# EAGLE board TwoMegCoCo_MMU_v1.1 (EAGLE 7.7.0)
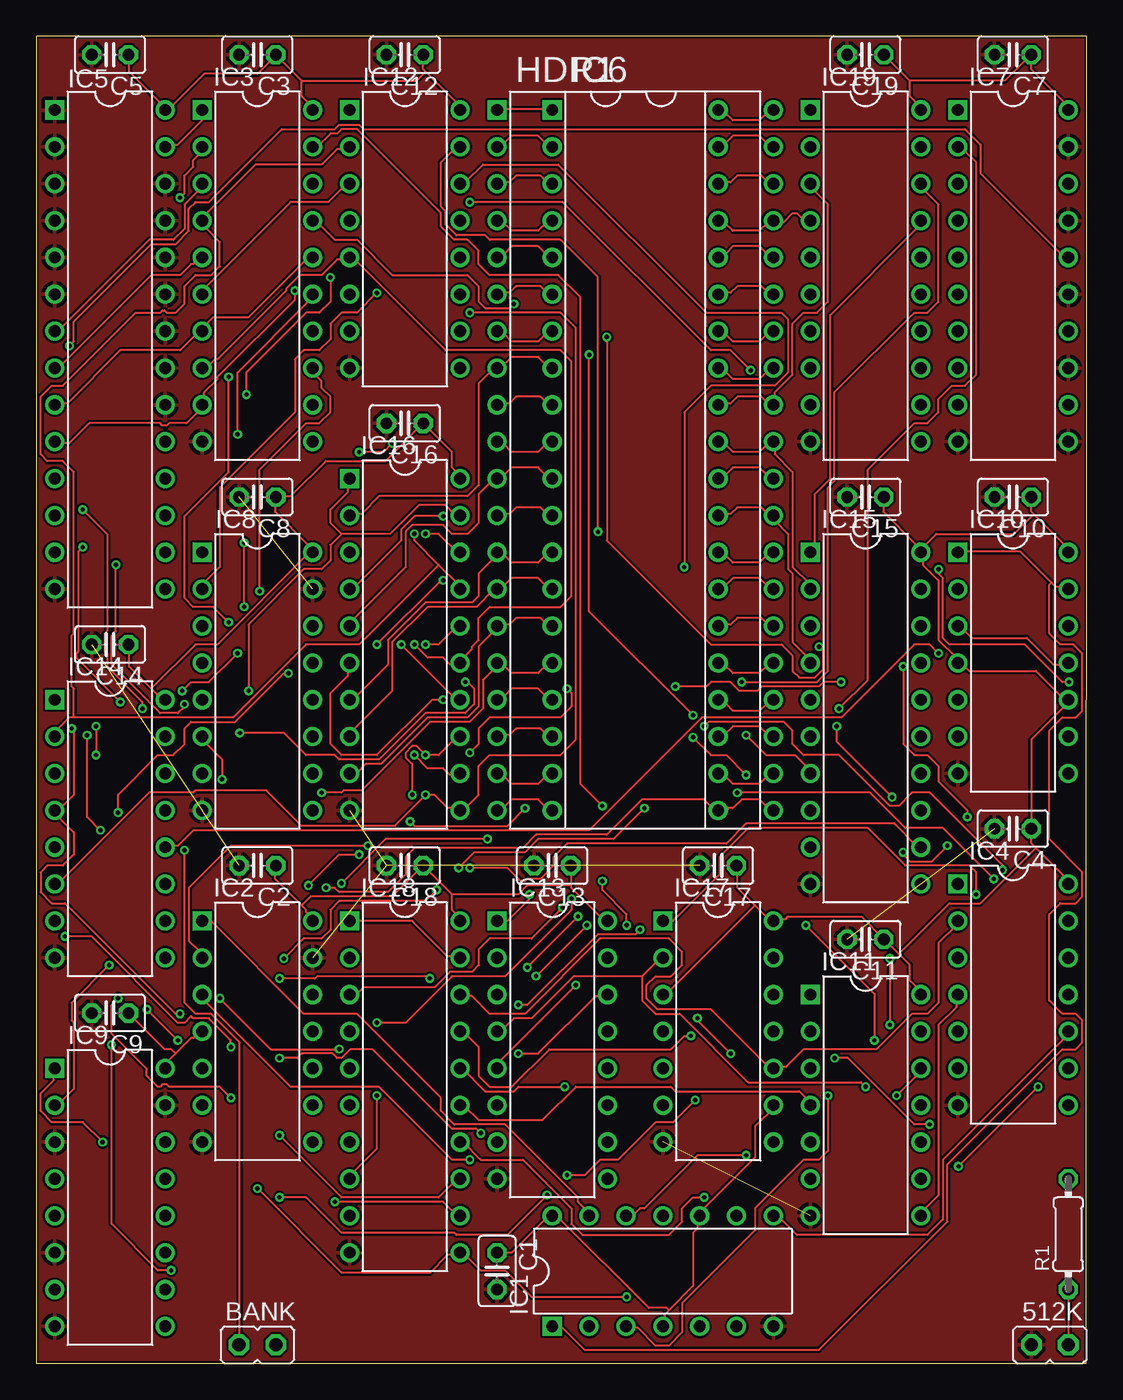
[diagram p1: board, top side]
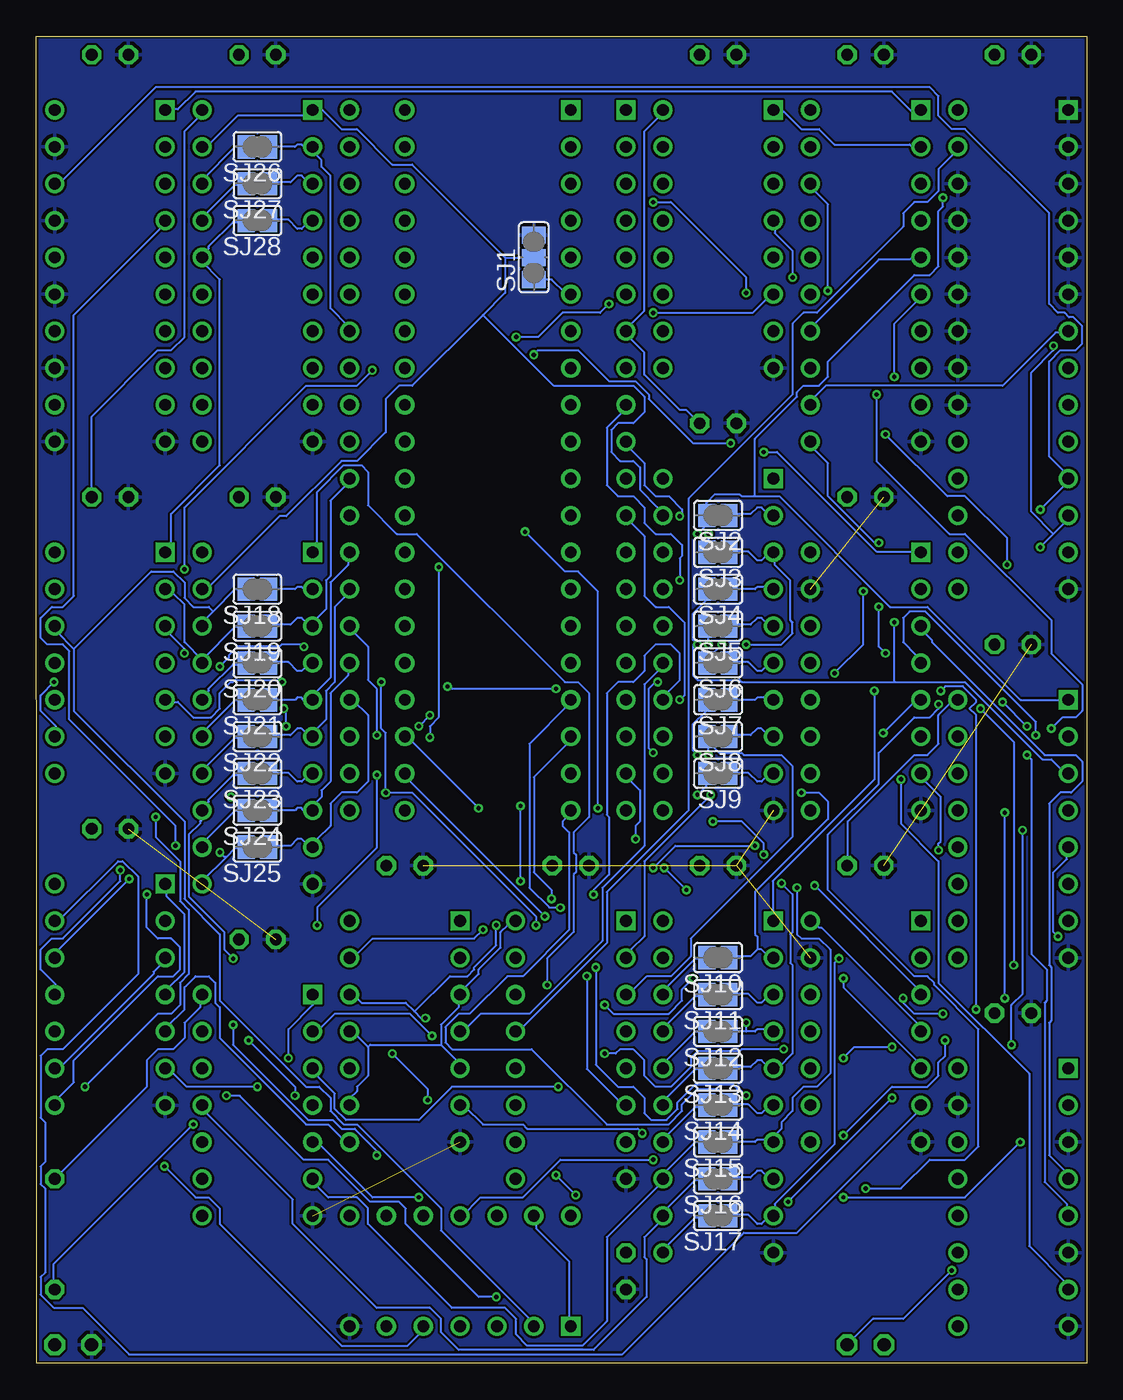
[diagram p2: board, bottom side, seen from below]

Size 72.39 x 91.44 mm. Coordinates in mm from the lower left corner, seen from the top.
Outline: 0,0 72.37,0 72.39,91.44 0,91.44 0,0
Copper layers (1*16): Top 0.035mm / dielectric 1.5mm / Bottom 0.035mm
Design rules "hackvana": minimum track width 6mil, minimum drill 0.3mm, track to track 6mil, track to pad 6mil, pad to pad 6mil, via to via 6mil, smd to smd 0mil, copper to edge 6mil, drill to drill 6mil, minimum pad ring 10mil, minimum via ring 6mil, stop-mask expansion 2mil, vias tented up to drill 100mil, thermal gap 10mil

## Footprints (pad centres in the part's own frame; a part is rotated, then mirrored left to right if it is on the bottom)
JP1 = drill 0.914 octagon: 1 0,-1.27; 2 0,1.27
C025-025X050 = drill 0.813 octagon: 1 -1.27,0; 2 1.27,0
DIL40-ROUNDPAD = drill 0.813 square: 1 -24.13,-7.62 | drill 0.813: 2 -21.59,-7.62; 3 -19.05,-7.62; 4 -16.51,-7.62; 5 -13.97,-7.62; 6 -11.43,-7.62; 7 -8.89,-7.62; 8 -6.35,-7.62; 9 -3.81,-7.62; 10 -1.27,-7.62; 11 1.27,-7.62; 12 3.81,-7.62; 13 6.35,-7.62; 14 8.89,-7.62; 15 11.43,-7.62; 16 13.97,-7.62; 17 16.51,-7.62; 18 19.05,-7.62; 19 21.59,-7.62; 20 24.13,-7.62; 21 24.13,7.62; 22 21.59,7.62; 23 19.05,7.62; 24 16.51,7.62; 25 13.97,7.62; 26 11.43,7.62; 27 8.89,7.62; 28 6.35,7.62; 29 3.81,7.62; 30 1.27,7.62; 31 -1.27,7.62; 32 -3.81,7.62; 33 -6.35,7.62; 34 -8.89,7.62; 35 -11.43,7.62; 36 -13.97,7.62; 37 -16.51,7.62; 38 -19.05,7.62; 39 -21.59,7.62; 40 -24.13,7.62
DIL14-RP = drill 0.813 square: 1 -7.62,-3.81 | drill 0.813: 2 -5.08,-3.81; 3 -2.54,-3.81; 4 0,-3.81; 5 2.54,-3.81; 6 5.08,-3.81; 7 7.62,-3.81; 8 7.62,3.81; 9 5.08,3.81; 10 2.54,3.81; 11 0,3.81; 12 -2.54,3.81; 13 -5.08,3.81; 14 -7.62,3.81
DIL20-RP = drill 0.813 square: 1 -11.43,-3.81 | drill 0.813: 2 -8.89,-3.81; 3 -6.35,-3.81; 4 -3.81,-3.81; 5 -1.27,-3.81; 6 1.27,-3.81; 7 3.81,-3.81; 8 6.35,-3.81; 9 8.89,-3.81; 10 11.43,-3.81; 11 11.43,3.81; 12 8.89,3.81; 13 6.35,3.81; 14 3.81,3.81; 15 1.27,3.81; 16 -1.27,3.81; 17 -3.81,3.81; 18 -6.35,3.81; 19 -8.89,3.81; 20 -11.43,3.81
DIL28-3-RP = drill 0.813 square: 1 -16.51,-3.81 | drill 0.813: 2 -13.97,-3.81; 3 -11.43,-3.81; 4 -8.89,-3.81; 5 -6.35,-3.81; 6 -3.81,-3.81; 7 -1.27,-3.81; 8 1.27,-3.81; 9 3.81,-3.81; 10 6.35,-3.81; 11 8.89,-3.81; 12 11.43,-3.81; 13 13.97,-3.81; 14 16.51,-3.81; 15 16.51,3.81; 16 13.97,3.81; 17 11.43,3.81; 18 8.89,3.81; 19 6.35,3.81; 20 3.81,3.81; 21 1.27,3.81; 22 -1.27,3.81; 23 -3.81,3.81; 24 -6.35,3.81; 25 -8.89,3.81; 26 -11.43,3.81; 27 -13.97,3.81; 28 -16.51,3.81
DIL16-RP = drill 0.813 square: 1 -8.89,-3.81 | drill 0.813: 2 -6.35,-3.81; 3 -3.81,-3.81; 4 -1.27,-3.81; 5 1.27,-3.81; 6 3.81,-3.81; 7 6.35,-3.81; 8 8.89,-3.81; 9 8.89,3.81; 10 6.35,3.81; 11 3.81,3.81; 12 1.27,3.81; 13 -1.27,3.81; 14 -3.81,3.81; 15 -6.35,3.81; 16 -8.89,3.81
0204/7 = drill 0.813 octagon: 1 -3.81,0; 2 3.81,0
SJ_2 = smd 1.168 x 1.6: 1 -1.524,0; 2 0,0; 3 1.524,0
SJ = smd 1.168 x 1.6: 1 -0.762,0; 2 0.762,0

## Placement (x,y rotation side)
512K  [JP1]  69.85,1.27 90 top
BANK  [JP1]  15.24,1.27 90 top
C1  [C025-025X050]  31.75,6.35 270 top
C2  [C025-025X050]  15.24,34.29 180 top
C3  [C025-025X050]  15.24,90.17 180 top
C4  [C025-025X050]  67.31,36.83 180 top
C5  [C025-025X050]  5.08,90.17 180 top
C7  [C025-025X050]  67.31,90.17 180 top
C8  [C025-025X050]  15.24,59.69 180 top
C9  [C025-025X050]  5.08,24.13 180 top
C10  [C025-025X050]  67.31,59.69 180 top
C11  [C025-025X050]  57.15,29.21 180 top
C12  [C025-025X050]  25.4,90.17 180 top
C13  [C025-025X050]  35.56,34.29 180 top
C14  [C025-025X050]  5.08,49.53 180 top
C15  [C025-025X050]  57.15,59.69 180 top
C16  [C025-025X050]  25.4,64.77 180 top
C17  [C025-025X050]  46.99,34.29 180 top
C18  [C025-025X050]  25.4,34.29 180 top
C19  [C025-025X050]  57.15,90.17 180 top
HDR1  MC6809ER  [DIL40-ROUNDPAD]  39.37,62.23 270 top
IC1  74HCT74N  [DIL14-RP]  43.18,6.35 0 top
IC2  74HCT74N  [DIL14-RP]  15.24,22.86 270 top
IC3  74LS244N  [DIL20-RP]  15.24,74.93 270 top
IC4  74LS32N  [DIL14-RP]  67.31,25.4 270 top
IC5  JEDEC_32KB_SRAM-TRP  [DIL28-3-RP]  5.08,69.85 270 top
IC6  MC6809ER  [DIL40-ROUNDPAD]  43.18,62.23 270 top
IC7  74LS244N  [DIL20-RP]  67.31,74.93 270 top
IC8  74LS157N  [DIL16-RP]  15.24,46.99 270 top
IC9  74LS157N  [DIL16-RP]  5.08,11.43 270 top
IC10  74LS74N  [DIL14-RP]  67.31,48.26 270 top
IC11  74LS30N  [DIL14-RP]  57.15,17.78 270 top
IC12  74LS138N  [DIL16-RP]  25.4,77.47 270 top
IC13  74LS138N  [DIL16-RP]  35.56,21.59 270 top
IC14  74LS138N  [DIL16-RP]  5.08,36.83 270 top
IC15  74LS245N  [DIL20-RP]  57.15,44.45 270 top
IC16  74LS541N  [DIL20-RP]  25.4,49.53 270 top
IC17  74LS10N  [DIL14-RP]  46.99,22.86 270 top
IC18  74LS541N  [DIL20-RP]  25.4,19.05 270 top
IC19  74LS541N  [DIL20-RP]  57.15,74.93 270 top
R1  10K  [0204/7]  71.12,8.89 90 top
SJ1  [SJ_2]  38.1,76.2 90 bottom
SJ2  [SJ]  25.4,58.42 180 bottom
SJ3  [SJ]  25.4,55.88 180 bottom
SJ4  [SJ]  25.4,53.34 180 bottom
SJ5  [SJ]  25.4,50.8 180 bottom
SJ6  [SJ]  25.4,48.26 180 bottom
SJ7  [SJ]  25.4,45.72 180 bottom
SJ8  [SJ]  25.4,43.18 180 bottom
SJ9  [SJ]  25.4,40.64 180 bottom
SJ10  [SJ]  25.4,27.94 180 bottom
SJ11  [SJ]  25.4,25.4 180 bottom
SJ12  [SJ]  25.4,22.86 180 bottom
SJ13  [SJ]  25.4,20.32 180 bottom
SJ14  [SJ]  25.4,17.78 180 bottom
SJ15  [SJ]  25.4,15.24 180 bottom
SJ16  [SJ]  25.4,12.7 180 bottom
SJ17  [SJ]  25.4,10.16 180 bottom
SJ18  [SJ]  57.15,53.34 180 bottom
SJ19  [SJ]  57.15,50.8 180 bottom
SJ20  [SJ]  57.15,48.26 180 bottom
SJ21  [SJ]  57.15,45.72 180 bottom
SJ22  [SJ]  57.15,43.18 180 bottom
SJ23  [SJ]  57.15,40.64 180 bottom
SJ24  [SJ]  57.15,38.1 180 bottom
SJ25  [SJ]  57.15,35.56 180 bottom
SJ26  [SJ]  57.15,83.82 180 bottom
SJ27  [SJ]  57.15,81.28 180 bottom
SJ28  [SJ]  57.15,78.74 180 bottom

## Tracks (layer width: path | path; a pad name or v marks a point on that pad's centre or on a via)
!A3  (via drill 0.3)
  Top 0.152: v1.98,29.41 3.81,29.41 9.75,23.47 10.21,23.47 10.67,23.93 10.82,23.77 11.89,23.77 13.41,22.25 v13.41,21.79 | v16.76,21.03 17.98,21.03 18.29,21.34 20.42,21.34 20.73,21.03 21.03,21.03 21.64,21.64 23.16,21.64 28.65,16.15 30.33,16.15 v30.63,15.85
  Bottom 0.152: v1.98,29.41 2.29,29.72 2.29,33.83 1.37,34.75 1.37,35.51 IC14.5 | v13.41,21.79 16,21.79 v16.76,21.03 | v30.63,15.85 30.94,16.15 38.56,16.15 38.86,16.46 41.6,16.46 42.82,17.68 43.13,17.68 IC17.6
!A8
  Bottom 0.152: IC17.8 50.9,15.24 51.21,15.54 51.36,15.54 52.27,16.46 53.8,16.46 59.74,22.4 59.74,24.54 60.05,24.84 60.05,26.21 60.5,26.67 61.42,26.67 62.18,25.91 62.18,24.38 63.4,23.16 63.4,22.86 IC4.5
!CE_FEXX
  Bottom 0.152: IC4.9 71.02,20.42 70.71,20.42 64.31,26.82 64.31,26.98 63.4,27.89 IC4.3
!CE_FEXX/FFXX
  Top 0.152: IC11.8 60.96,10.21 61.27,10.52 61.27,10.67 62.18,11.58 62.18,23.32 63.4,24.54 63.4,25.3 IC4.4
  Bottom 0.152: IC4.1 63.4,32.92 63.4,32.16 62.18,30.94 62.18,26.98 63.4,25.76 63.4,25.45 IC4.4
!CE_FFXX  (via drill 0.3)
  Top 0.152: 41.76,26.67 37.03,26.67 34.14,23.77 32.92,23.77 32.31,23.16 32.16,23.16 31.85,22.86 IC13.4 | 41.76,26.67 43.13,28.04 IC17.2 | v57.15,19.05 56.83,19.37 49.06,19.37 44.35,24.08 42.67,24.08 41.76,24.99 41.76,26.67
  Bottom 0.152: v57.15,19.05 62.03,19.05 62.94,19.96 63.09,19.96 63.4,20.27 IC4.6
!CRM
  Top 0.152: IC1.8 50.9,10.06 51.21,10.06 52.43,8.84 61.42,8.84 62.48,9.91 62.48,14.02 71.02,22.55 71.02,22.86 IC4.10
!CRM_ACCESS  (via drill 0.3)
  Top 0.152: IC17.1 43.89,30.48 47.09,33.68 47.09,34.9 49.07,36.88 57.3,36.88 59.89,34.29 64.31,34.29 64.77,33.83 v64.77,32.31
  Bottom 0.152: v64.77,32.31 64.77,30.02 64.01,29.26 63.09,29.26 62.48,28.65 62.48,27.13 62.94,26.67 64.01,26.67 69.8,20.88 69.8,19.36 71.02,18.14 71.02,17.83 IC4.8
!FIRQ
  Top 0.152: HDR1.4 31.85,78.64 32.16,78.64 32.77,78.03 34.59,78.03 35.2,78.64 35.51,78.64 IC6.4
!HALT
  Top 0.152: HDR1.40 47.09,86.26 47.4,86.26 48.01,85.65 49.84,85.65 50.44,86.26 50.75,86.26 IC6.40
!IRQ
  Top 0.152: HDR1.3 31.85,81.38 32.61,81.38 33.07,81.84 34.75,81.84 35.2,81.38 35.51,81.38 IC6.3
!MMU_EN
  Bottom 0.152: IC4.13 70.87,30.48 66.75,34.59 66.45,34.59 65.38,33.53 65.38,26.82 70.56,21.64 71.63,21.64 72.08,21.18 72.08,16.92 71.78,16.61 71.78,13.87 72.08,13.56 72.08,12.34 71.78,12.04 71.78,6.25 72.08,5.94 72.08,4.72 71.17,3.81 69.19,3.81 65.99,0.61 32,0.61 23.62,8.99 19.96,8.99 11.73,17.22 11.73,17.37 11.43,17.68 IC2.6
!MMU_SEL  (via drill 0.3)
  Top 0.152: v4.57,15.24 3.2,16.61 1.07,16.61 0.3,17.37 0.3,18.59 1.22,19.51 1.22,20.27 IC9.1 | v16.76,11.43 18.59,11.43 21.03,8.99 28.8,8.99 28.96,8.84 32.46,8.84 v35.2,11.58 | v36.58,12.95 37.8,12.95 38.86,14.02 40.08,14.02 42.67,16.61 43.89,16.61 v45.41,18.14 | v47.85,21.34 45.57,23.62 v45.57,23.77 | IC3.19 19.36,83.82 20.27,84.73 20.73,84.73 21.03,85.04 22.1,85.04 27.89,79.25 27.89,78.33 28.8,77.42 29.72,77.42 30.48,76.66 30.48,75.74 31.24,74.98 35.97,74.98 37.49,73.46 37.49,39.93 v39.01,38.41 | v39.01,33.22 39.01,32.61 40.69,30.94 v40.69,30.18
  Bottom 0.152: v4.57,15.24 8.38,11.43 v16.76,11.43 | v36.58,12.95 v35.2,11.58 | v45.41,18.14 45.41,18.9 v47.85,21.34 | v45.57,23.77 45.87,23.77 46.33,24.23 | 46.33,24.23 46.94,24.84 49.99,24.84 50.44,25.3 50.75,25.3 IC17.12 | v39.01,33.22 v39.01,38.41 | v40.69,30.18 40.69,28.8 42.22,27.28 42.22,27.13 42.67,26.67 43.89,26.67 46.33,24.23
!NMI
  Top 0.152: IC6.2 35.36,83.82 34.59,84.58 32.77,84.58 32.31,84.12 32.16,84.12 31.85,83.82 HDR1.2
!RESET
  Top 0.152: HDR1.37 47.09,78.64 47.4,78.64 48.01,78.03 49.84,78.03 50.44,78.64 50.75,78.64 IC6.37 50.9,78.64 51.51,78.64 52.12,79.25 52.43,79.25 52.88,78.79 53.34,78.79 IC19.4
  Bottom 0.152: SJ28.1 56.39,78.79 55.02,78.79 54.41,78.18 54.1,78.18 53.65,78.64 53.34,78.64 IC19.4
!RESET'
  Top 0.152: 69.95,53.8 70.26,53.49 70.87,53.49 71.02,53.34 IC10.13 | 69.95,53.8 67.82,55.93 63.55,55.93 IC10.1 | IC2.1 12.04,30.48 18.44,24.08 22.1,24.08 27.89,18.29 27.89,17.37 28.8,16.46 32.31,16.46 37.34,11.43 37.34,11.12 38.1,10.36 IC1.13 | 69.95,53.8 69.8,53.65 69.8,50.29 70.56,49.53 71.48,49.53 72.08,48.92 72.08,44.96 71.63,44.5 70.71,44.5 69.8,43.59 69.8,36.12 72.08,33.83 72.08,32.16 71.63,31.7 70.56,31.7 69.8,30.94 69.8,24.99 70.71,24.08 71.63,24.08 72.08,23.62 72.08,22.1 71.63,21.64 70.71,21.64 62.79,13.72 62.79,9.75 53.95,0.91 37.8,0.91 36.27,2.44 35.66,2.44 IC1.1
  Bottom 0.152: SJ28.2 57.91,78.64 58.83,78.64 60.5,76.96 60.5,76.81 60.96,76.35 IC19.16 60.96,75.89 59.74,74.68 59.74,61.87 63.09,58.52 63.09,56.24 63.4,55.93 IC10.1 | IC1.1 35.66,2.59 35.66,7.01 37.95,9.3 37.95,9.91 38.1,10.06 IC1.13
!WE_FF9B  (via drill 0.3)
  Top 0.152: v62.18,48.92 61.57,49.53 60.5,49.53 55.47,44.5 45.87,44.5 38.1,36.73 10.82,36.73 9.75,35.66 8.99,35.66 IC14.12 | IC10.11 71.02,48.16 70.1,48.16 68.28,49.99 64.47,49.99 63.55,50.9 IC10.3
  Bottom 0.152: v62.18,48.92 62.18,49.23 63.4,50.44 63.4,50.75 IC10.3
!WE_FF9X  (via drill 0.3)
  Top 0.152: 1.37,38.1 1.68,38.41 1.83,38.41 2.59,39.17 2.59,43.59 v2.44,43.74 | v14.48,66.75 14.48,68.28 18.59,72.39 19.51,72.39 20.27,73.15 v20.27,74.83 | v33.22,21.34 34.59,21.34 38.56,25.3 39.32,25.3 IC13.14 | v20.88,21.64 16.15,21.64 v12.65,25.15 | v9.91,24.08 9.6,24.08 1.98,31.7 1.07,31.7 0.3,32.46 0.3,33.83 0.76,34.29 1.83,34.29 2.59,35.05 2.59,36.58 1.37,37.8 1.37,38.1 | 1.37,38.1 IC14.4
  Bottom 0.152: v2.44,43.74 1.68,44.5 0.76,44.5 0.3,44.96 0.3,46.79 2.44,48.92 2.44,51.21 8.38,57.15 9.45,57.15 14.48,62.18 v14.48,66.75 | v20.27,74.83 20.27,76.66 21.49,77.88 21.49,78.64 IC12.4 | v33.22,21.34 32.46,21.34 32.16,21.64 31.24,21.64 30.48,20.88 30.48,19.81 29.72,19.05 28.65,19.05 27.28,20.42 27.28,21.03 26.82,21.49 23.93,21.49 23.77,21.64 v20.88,21.64 | v12.65,25.15 12.65,24.84 11.89,24.08 v9.91,24.08
!WE_FF90  (via drill 0.3)
  Top 0.152: v29.87,14.02 28.65,14.02 23.62,19.05 17.53,19.05 11.73,24.84 11.73,24.99 11.43,25.3 IC2.3 | v38.71,57.3 38.71,74.83 36.12,77.42 31.24,77.42 30.94,77.72 28.96,77.72 28.19,78.49 28.19,79.4 27.89,79.7 27.89,82.75 28.65,83.52 28.8,83.52 29.11,83.82 IC12.15 | v33.68,38.25 32.46,37.03 26.06,37.03 v25.76,37.34 | v22.25,35.05 20.88,35.05 v18.75,32.92
  Bottom 0.152: v29.87,14.02 36.27,14.02 38.86,11.43 41.76,11.43 43.13,10.06 IC1.11 | v38.71,57.3 35.97,54.56 35.05,54.56 33.68,53.19 v33.68,38.25 | v25.76,37.34 23.77,37.34 22.25,35.81 v22.25,35.05 | v18.75,32.92 11.43,25.6 IC2.3
!WE_FF91  (via drill 0.3)
  Top 0.152: v54.56,18.44 54.56,14.63 53.95,14.02 52.88,14.02 49.53,10.67 49.53,9.14 44.5,4.12 44.5,2.13 43.59,1.22 42.67,1.22 41.45,2.44 40.69,2.44 IC1.3 | v57.76,22.25 57.76,25.45 v53.03,30.18 | v48.92,40.54 47.55,41.91 46.48,41.91 v45.26,43.13 | v44.65,54.86 44.65,65.53 46.48,67.36 50.9,67.36 51.82,68.28 51.82,71.93 51.36,72.39 46.18,72.39 35.97,82.6 30.79,82.6 29.57,81.38 29.26,81.38 IC12.14
  Bottom 0.152: v54.56,18.44 54.56,19.05 v57.76,22.25 | v53.03,30.18 53.03,31.39 48.92,35.51 v48.92,40.54 | v45.26,43.13 45.26,43.89 44.65,44.5 v44.65,54.86
!WE_FFAX
  Top 0.152: IC3.1 11.43,85.65 9.75,83.97 9.14,83.97 8.99,83.82 IC5.27
  Bottom 0.152: IC13.13 39.32,22.86 39.01,23.16 38.86,23.16 33.07,28.96 33.07,32.46 27.43,38.1 27.43,59.59 20.27,66.75 20.27,71.63 19.51,72.39 18.59,72.39 12.65,78.33 12.65,79.25 11.89,80.01 10.97,80.01 10.21,80.77 10.21,82.3 8.99,83.52 8.99,83.82 IC5.27 | IC7.1 63.4,86.41 62.64,86.41 61.42,87.63 13.41,87.63 12.04,86.26 11.43,86.26 IC3.1
A0
  Top 0.152: IC6.8 35.36,68.58 34.59,69.34 32.77,69.34 32.31,68.89 32.16,68.89 31.85,68.58 HDR1.8 31.55,68.58 30.48,67.51 30.48,60.5 29.72,59.74 23.62,59.74 22.4,58.52 21.64,58.52 IC16.2
  Bottom 0.152: SJ2.1 24.54,58.52 23.16,58.52 22.71,58.98 22.4,58.98 21.95,58.52 21.64,58.52 IC16.2
A0'  (via drill 0.3)
  Top 0.152: v26.82,57.15 27.74,57.15 29.11,55.78 IC16.18 | IC3.2 11.43,83.52 10.82,82.91 10.82,82.45 10.21,81.84 10.21,80.62 v9.91,80.31
  Bottom 0.152: IC3.2 12.04,83.82 12.19,83.97 17.37,83.97 18.44,85.04 19.66,85.04 20.88,86.26 21.49,86.26 IC12.1 | v26.82,57.15 26.21,57.76 26.21,58.37 SJ2.2 26.21,58.52 26.21,59.28 25.6,59.89 23.93,59.89 23.77,59.74 22.86,59.74 | IC14.1 4.57,45.72 10.97,52.12 13.56,52.12 21.18,59.74 22.86,59.74 | v9.91,80.31 9.91,79.7 10.21,79.4 10.21,75.59 10.82,74.98 11.89,74.98 17.83,69.04 17.83,67.97 18.44,67.36 19.51,67.36 19.96,66.9 19.96,66.6 22.86,63.7 22.86,59.74
A1  (via drill 0.3)
  Top 0.152: HDR1.9 31.85,66.14 32.61,66.14 33.07,66.6 34.75,66.6 35.2,66.14 35.51,66.14 IC6.9 | v23.47,49.53 27.89,53.95 v28.04,53.95
  Bottom 0.152: SJ3.1 24.54,55.93 23.32,55.93 22.71,55.32 22.4,55.32 21.95,55.78 21.64,55.78 IC16.3 21.49,55.78 21.49,55.02 20.42,53.95 20.42,51.21 20.27,51.05 20.27,50.29 21.03,49.53 v23.47,49.53 | v28.04,53.95 28.04,55.47 27.89,55.63 27.89,56.39 28.65,57.15 29.72,57.15 30.48,57.91 30.48,58.98 31.24,59.74 32.31,59.74 33.07,60.5 33.07,64.47 31.85,65.68 31.85,65.99 HDR1.9
A1'  (via drill 0.3)
  Top 0.152: IC12.2 21.49,83.82 21.34,83.67 20.73,83.67 19.66,82.6 15.09,82.6 11.73,79.25 11.73,79.1 11.43,78.79 IC3.4 11.43,78.64 11.73,78.33 11.73,78.18 12.65,77.27 12.65,75.59 12.04,74.98 10.97,74.98 10.21,74.22 10.21,73 9.6,72.39 8.99,72.39 8.84,72.54 8.69,72.54 8.53,72.39 6.86,72.39 1.83,67.36 1.07,67.36 0.3,66.6 0.3,62.64 0.76,62.18 1.83,62.18 2.59,61.42 2.59,50.29 2.44,50.14 2.44,46.63 2.59,46.48 2.59,44.5 | v26.06,57.15 26.06,56.69 27.74,55.02 | 27.74,55.02 29.11,53.65 29.11,53.34 IC16.17 | 2.59,44.5 13.56,44.5 18.59,49.53 22.25,49.53 27.74,55.02 | 2.59,44.5 2.29,44.5 1.37,43.59 1.37,43.28 IC14.2
  Bottom 0.152: v26.06,57.15 26.06,55.93 SJ3.2
A2  (via drill 0.3)
  Top 0.152: HDR1.10 31.85,63.4 32.16,63.4 32.77,62.79 34.59,62.79 35.2,63.4 35.51,63.4 IC6.10 | v28.04,58.37 26.06,58.37 25.15,57.45 25.15,56.69 22.1,53.65 21.95,53.65 21.64,53.34 IC16.4
  Bottom 0.152: SJ4.1 22.86,53.34 22.71,53.49 21.79,53.49 21.64,53.34 IC16.4 | v28.04,58.37 27.89,58.52 27.89,58.83 28.8,59.74 29.72,59.74 30.48,60.5 30.48,62.03 31.85,63.4 HDR1.10
A2'  (via drill 0.3)
  Top 0.152: IC3.6 11.43,73.76 11.73,74.07 11.73,74.22 17.53,80.01 20.12,80.01 21.49,81.38 IC12.3 | v26.82,49.53 27.74,49.53 29.11,50.9 IC16.16 | v13.26,67.97 13.26,61.42 10.21,58.37 10.21,52.73 10.82,52.12 12.19,52.12 v13.26,51.05
  Bottom 0.152: 26.98,49.68 27.13,49.84 27.13,51.66 26.21,52.58 26.21,53.34 SJ4.2 | 13.26,46.94 23.77,46.94 23.93,47.09 26.82,47.09 27.13,47.4 27.13,49.53 26.98,49.68 | 13.26,46.94 8.38,46.94 3.05,41.6 2.44,41.6 1.83,41 1.68,41 1.37,40.69 IC14.3 | 26.98,49.68 v26.82,49.53 | v13.26,67.97 13.26,71.63 11.73,73.15 11.73,73.3 11.43,73.61 IC3.6 | 13.26,46.94 v13.26,51.05
A3
  Top 0.152: IC6.11 35.36,60.96 34.59,61.72 32.77,61.72 32.31,61.27 32.16,61.27 31.85,60.96 HDR1.11 31.55,60.96 30.48,59.89 30.48,57.91 29.72,57.15 28.65,57.15 28.04,57.76 25.91,57.76 25.45,57.3 25.45,54.86 21.95,51.36 21.95,51.21 21.64,50.9 IC16.5
  Bottom 0.152: SJ5.1 24.54,50.9 23.16,50.9 22.71,51.36 22.4,51.36 21.95,50.9 21.64,50.9 IC16.5
A3'  (via drill 0.3)
  Top 0.152: IC3.8 11.73,68.58 12.34,69.19 12.5,69.19 17.22,73.91 17.22,74.07 18.14,74.98 19.66,74.98 20.73,76.05 21.34,76.05 21.49,76.2 IC12.5 21.64,76.2 21.95,75.89 22.1,75.89 28.19,69.8 36.12,69.8 36.88,69.04 36.88,52.88 36.12,52.12 31.24,52.12 30.48,51.36 30.48,49.84 30.02,49.38 30.02,49.23 29.11,48.31 IC16.15 29.11,48.16 28.5,48.16 28.04,48.62 26.98,48.62 v26.06,49.53
  Bottom 0.152: v26.06,49.53 26.06,50.75 SJ5.2 | IC17.4 43.13,22.86 42.82,23.16 42.67,23.16 41.76,24.08 38.41,24.08 33.38,29.11 33.38,32.77 30.48,35.66 30.48,46.79 29.11,48.16 IC16.15
A4  (via drill 0.3)
  Top 0.152: HDR1.12 31.85,58.52 32.61,58.52 33.07,58.98 34.75,58.98 35.2,58.52 35.51,58.52 IC6.12 | v28.04,45.72 27.28,45.72 23.47,41.91 21.03,41.91 20.27,42.67 20.27,46.18 21.49,47.4 21.49,48.16 IC16.6
  Bottom 0.152: SJ6.1 24.54,48.31 23.32,48.31 22.71,47.7 22.4,47.7 21.95,48.16 21.64,48.16 IC16.6 | v28.04,45.72 27.74,46.02 27.74,51.05 28.8,52.12 29.72,52.12 30.48,52.88 30.48,57 31.85,58.37 HDR1.12
A4'  (via drill 0.3)
  Top 0.152: v25.15,49.53 28.96,45.72 IC16.14 | IC13.1 32.46,30.48 33.98,32 v33.98,32.31
  Bottom 0.152: v25.15,49.53 26.06,48.62 26.06,48.31 SJ6.2 | v33.98,32.31 33.98,32.61 32.92,33.68 32.92,37.64 33.07,37.8 33.07,46.18 32.31,46.94 31.24,46.94 30.48,47.7 30.48,48.77 29.72,49.53 28.65,49.53 28.04,48.92 28.04,47.09 29.11,46.02 29.11,45.72 IC16.14
A5
  Top 0.152: 31.85,55.78 32.16,55.78 32.77,55.17 34.59,55.17 35.2,55.78 35.51,55.78 IC6.13 | 31.85,55.78 30.48,54.41 30.48,52.88 30.02,52.43 26.82,52.43 24.23,49.84 24.23,48.16 22.1,46.02 21.95,46.02 21.64,45.72 IC16.7 | 31.85,55.78 HDR1.13
  Bottom 0.152: SJ7.1 22.86,45.72 22.71,45.87 21.79,45.87 21.64,45.72 IC16.7
A5'  (via drill 0.3)
  Top 0.152: IC16.13 29.11,43.28 27.74,41.91 v26.82,41.91 26.21,42.52 25.91,42.52 25.45,42.06 25.45,41.76 25.91,41.3 v25.91,39.17
  Bottom 0.152: v26.82,41.91 27.13,42.22 27.13,44.04 26.21,44.96 26.21,45.72 SJ7.2 | v25.91,39.17 30.48,34.59 30.48,29.41 31.39,28.5 31.39,28.35 31.7,28.04 IC13.2
A6
  Top 0.152: IC6.14 35.36,53.34 34.59,54.1 32.77,54.1 32.31,53.65 32.16,53.65 31.85,53.34 HDR1.14 31.55,53.34 30.33,52.12 26.98,52.12 24.54,49.68 24.54,46.33 21.95,43.74 21.95,43.59 21.64,43.28 IC16.8
  Bottom 0.152: SJ8.1 24.54,43.28 23.16,43.28 22.71,43.74 22.4,43.74 21.95,43.28 21.64,43.28 IC16.8
A6'  (via drill 0.3)
  Top 0.152: v26.06,41.91 26.98,41 28.04,41 28.5,40.54 29.11,40.54 IC16.12
  Bottom 0.152: v26.06,41.91 26.06,42.82 | 26.06,42.82 26.06,43.13 SJ8.2 26.06,42.82 | IC13.3 31.39,25.76 31.24,25.76 30.33,26.67 28.65,26.67 27.28,28.04 27.28,29.26 20.27,36.27 20.27,41.15 21.03,41.91 23.62,41.91 23.77,42.06 25.3,42.06 26.06,42.82
A7
  Top 0.152: IC6.15 35.51,50.9 35.2,50.9 34.75,51.36 33.07,51.36 32.61,50.9 31.85,50.9 HDR1.15 31.85,50.75 30.48,49.38 30.48,45.26 29.72,44.5 26.98,44.5 23.77,41.3 22.71,41.3 22.1,40.69 21.64,40.69 IC16.9
  Bottom 0.152: SJ9.1 24.54,40.69 23.32,40.69 22.71,40.08 22.4,40.08 21.95,40.54 21.64,40.54 IC16.9
A7'  (via drill 0.3)
  Top 0.152: IC14.6 1.37,33.07 1.68,33.38 1.83,33.38 7.77,39.32 10.82,39.32 10.97,39.47 15.85,39.47 18.29,37.03 24.69,37.03 v26.82,39.17 27.43,39.17 28.35,38.25 28.96,38.25 29.11,38.1 IC16.11 29.41,38.1 30.48,39.17 30.48,41.15 31.24,41.91 36.12,41.91 37.19,42.98 37.19,71.32 36.12,72.39 v29.87,72.39
  Bottom 0.152: v26.82,39.17 26.21,39.78 26.21,40.54 SJ9.2 | IC12.6 21.95,73.3 22.1,73.3 23.01,72.39 v29.87,72.39
A8  (via drill 0.3)
  Top 0.152: 31.85,48.16 32.16,48.16 32.77,47.55 34.59,47.55 35.2,48.16 35.51,48.16 IC6.16 | v19.66,39.32 21.03,39.32 21.18,39.47 22.4,39.47 27.13,44.2 29.87,44.2 30.79,45.11 30.79,47.09 31.85,48.16 | 31.85,48.16 HDR1.16
  Bottom 0.152: 22.71,28.5 23.16,28.04 24.54,28.04 SJ10.1 | 22.71,28.5 22.4,28.5 21.95,28.04 21.64,28.04 IC18.2 | 22.71,28.5 22.71,29.41 22.86,29.57 22.86,32.46 17.83,37.49 17.83,38.71 18.44,39.32 v19.66,39.32
A8'
  Top 0.152: IC4.2 63.4,30.48 63.4,30.18 62.18,28.96 62.18,24.84 61.42,24.08 60.35,24.08 57.91,21.64 52.88,21.64 51.66,20.42 50.9,20.42 IC17.10 50.75,20.42 50.44,20.42 46.48,24.38 42.82,24.38 42.06,25.15 42.06,26.06 42.67,26.67 43.74,26.67 44.5,27.43 44.5,28.35 43.59,29.26 38.86,29.26 33.68,24.08 31.24,24.08 30.02,25.3 29.26,25.3 IC18.18
  Bottom 0.152: SJ10.2 26.21,27.89 26.98,27.89 29.11,25.76 29.11,25.45 IC18.18
A9  (via drill 0.3)
  Top 0.152: IC6.17 35.36,45.72 34.59,46.48 32.77,46.48 32.31,46.02 32.16,46.02 31.85,45.72 HDR1.17 | v36.27,31.39 34.14,29.26 31.24,29.26 30.48,28.5 30.48,27.43 30.02,26.98 28.5,26.98 27.43,25.91 22.55,25.91 22.1,25.45 21.64,25.45 IC18.3
  Bottom 0.152: SJ11.1 24.54,25.45 23.32,25.45 22.71,24.84 22.4,24.84 21.95,25.3 21.64,25.3 IC18.3 | v36.27,31.39 37.03,31.39 38.41,32.77 38.41,42.67 35.66,45.41 35.66,45.72 IC6.17
A9'  (via drill 0.3)
  Top 0.152: v45.11,22.55 44.65,22.55 43.74,21.64 35.36,21.64 32.77,19.05 31.24,19.05 30.48,19.81 30.48,21.79 29.41,22.86 IC18.17
  Bottom 0.152: SJ11.2 26.21,25.3 26.98,25.3 29.11,23.16 29.11,22.86 IC18.17 | IC11.2 53.03,22.86 51.82,24.08 46.63,24.08 v45.11,22.55
A10  (via drill 0.3)
  Top 0.152: HDR1.18 31.85,43.28 32.61,43.28 33.07,43.74 34.75,43.74 35.2,43.28 35.51,43.28 IC6.18 | v23.47,23.47 25.45,23.47 28.65,26.67 32.31,26.67 36.88,31.24 v36.88,32
  Bottom 0.152: 23.47,22.86 22.86,22.86 22.71,23.01 21.79,23.01 21.64,22.86 IC18.4 | 23.47,22.86 SJ12.1 | v23.47,23.47 23.47,22.86 | v36.88,32 36.88,32.61 38.1,33.83 38.1,40.39 35.66,42.82 35.66,43.13 IC6.18
A10'  (via drill 0.3)
  Top 0.152: v36.42,19.05 33.22,19.05 32.92,18.75 30.94,18.75 29.26,20.42 IC18.16
  Bottom 0.152: SJ12.2 26.98,22.86 29.11,20.73 29.11,20.42 IC18.16 | v36.42,19.05 43.74,19.05 46.02,16.76 51.05,16.76 51.82,17.53 51.82,18.59 53.03,19.81 53.03,19.96 53.34,20.27 IC11.3
A11  (via drill 0.3)
  Top 0.152: HDR1.19 31.85,40.54 32.16,40.54 32.77,39.93 34.59,39.93 35.2,40.54 35.51,40.54 IC6.19 | v21.03,33.07 24.08,36.12 v31.09,36.12
  Bottom 0.152: SJ13.1 24.54,20.42 23.16,20.42 22.71,20.88 22.4,20.88 21.95,20.42 21.64,20.42 IC18.5 21.49,20.42 21.18,20.42 20.27,21.34 20.27,27.43 20.42,27.58 20.42,29.57 20.27,29.72 20.27,32.31 v21.03,33.07 | v31.09,36.12 31.09,37.03 30.79,37.34 30.79,39.47 31.85,40.54 HDR1.19
A11'
  Top 0.152: IC11.4 53.34,17.83 53.03,18.14 53.03,18.29 52.58,18.75 44.04,18.75 43.74,19.05 37.19,19.05 34.9,16.76 30.48,16.76 29.57,17.68 29.26,17.68 IC18.15
  Bottom 0.152: SJ13.2 26.21,20.27 26.98,20.27 29.11,18.14 29.11,17.83 IC18.15
A12
  Top 0.152: IC6.20 35.36,38.1 34.59,38.86 32.77,38.86 32.31,38.41 32.16,38.41 31.85,38.1 HDR1.20
  Bottom 0.152: IC18.6 21.64,17.68 21.95,17.68 22.4,17.22 22.71,17.22 23.32,17.83 24.54,17.83 SJ14.1 24.69,17.83 24.69,18.14 25.45,18.9 26.82,18.9 27.89,17.83 27.89,17.37 28.8,16.46 33.07,16.46 38.25,21.64 43.74,21.64 44.2,22.1 44.2,23.16 43.28,24.08 42.52,24.08 39.93,26.67 38.86,26.67 35.66,29.87 35.66,36.58 36.12,37.03 36.12,37.34 35.66,37.8 35.66,38.1 IC6.20
A12'  (via drill 0.3)
  Top 0.152: v46.02,11.43 45.26,11.43 44.5,10.67 44.5,9.75 43.59,8.84 37.64,8.84 36.88,9.6 36.88,10.67 33.53,14.02 30.63,14.02 29.41,15.24 IC18.14
  Bottom 0.152: SJ14.2 26.21,17.68 26.98,17.68 29.11,15.54 29.11,15.24 IC18.14 | IC11.5 53.03,15.24 49.23,11.43 v46.02,11.43
A13  (via drill 0.3)
  Top 0.152: IC6.21 50.6,38.1 49.84,38.86 48.62,38.86 48.01,38.25 47.7,38.25 47.55,38.1 HDR1.21 46.79,38.1 46.02,38.86 41.76,38.86 39.32,36.42 34.44,36.42 33.53,35.51 26.06,35.51 25.45,34.9 25.45,33.68 24.23,32.46 20.88,32.46 20.57,32.77 v19.96,32.77
  Bottom 0.152: SJ15.1 22.86,15.24 22.71,15.39 21.79,15.39 | 21.79,15.39 21.64,15.24 IC18.7 21.79,15.39 | 21.79,15.39 21.03,16.15 21.03,16.61 20.27,17.37 20.27,18.29 19.51,19.05 18.59,19.05 17.68,19.96 17.68,28.5 18.44,29.26 19.66,29.26 19.96,29.57 v19.96,32.77
A13'  (via drill 0.3)
  Top 0.152: v14.33,52.12 v14.33,56.54 | v13.87,48.92 11.89,46.94 10.67,46.94 v10.06,46.33 | v9.75,22.25 v7.62,24.38 | v16.76,15.7 21.03,11.43 27.74,11.43 29.11,12.8 IC18.13
  Bottom 0.152: SJ15.2 26.98,15.24 29.11,13.11 29.11,12.8 IC18.13 29.11,12.65 33.07,8.69 33.07,2.9 34.75,1.22 38.56,1.22 39.32,1.98 39.32,3.05 40.08,3.81 43.74,3.81 49.53,9.6 49.53,10.67 50.29,11.43 52.27,11.43 53.03,12.19 53.03,12.34 53.34,12.65 IC11.6 | v14.33,56.54 14.63,56.54 17.83,59.74 17.83,62.03 18.75,62.94 18.75,63.09 19.05,63.4 IC3.11 | v14.33,52.12 14.33,49.38 v13.87,48.92 | v10.06,46.33 9.75,46.63 8.53,46.63 7.62,45.72 7.62,45.57 8.08,45.11 7.62,44.65 v7.62,24.38 | v9.75,22.25 9.75,21.18 10.21,20.73 10.21,19.81 10.97,19.05 13.41,19.05 v16.76,15.7
A14  (via drill 0.3)
  Top 0.152: HDR1.22 47.09,40.54 47.4,40.54 48.01,39.93 49.84,39.93 50.44,40.54 50.75,40.54 IC6.22 | v23.47,18.44 23.47,14.78 21.95,13.26 21.95,13.11 21.64,12.8 IC18.8 | v37.34,30.79 v33.83,27.28
  Bottom 0.152: SJ16.1 24.54,12.8 23.16,12.8 22.71,13.26 22.4,13.26 21.95,12.8 21.64,12.8 IC18.8 | v23.47,18.44 23.93,18.9 24.08,18.9 24.38,19.2 26.98,19.2 28.19,17.98 28.19,17.53 28.96,16.76 30.02,16.76 30.48,17.22 30.48,18.29 31.24,19.05 32.31,19.05 33.83,20.57 v33.83,27.28 | v37.34,30.79 47.09,40.54 HDR1.22
A14'  (via drill 0.3)
  Top 0.152: IC3.13 19.05,68.28 19.66,67.67 19.66,67.21 20.27,66.6 20.27,65.53 19.51,64.77 18.59,64.77 15.39,61.57 v15.39,53.19 | v17.37,47.55 17.07,47.55 13.72,44.2 10.67,44.2 10.21,43.74 10.21,42.67 9.45,41.91 8.38,41.91 5.64,39.17 v5.64,37.95 | v5.64,25.15 5.18,24.69 5.18,22.71 7.62,20.27 7.62,19.81 8.38,19.05 8.53,19.05 8.69,19.2 8.99,19.2 9.14,19.05 12.65,19.05 v13.41,18.29 | v20.57,11.12 28.04,11.12 29.11,10.06 IC18.12
  Bottom 0.152: SJ16.2 26.21,12.65 26.98,12.65 29.11,10.52 29.11,10.21 IC18.12 29.11,10.06 30.48,8.69 30.48,7.32 30.33,7.16 30.33,4.57 33.98,0.91 43.28,0.91 44.5,2.13 44.5,3.05 45.26,3.81 48.92,3.81 54.71,9.6 54.71,11.28 60.66,17.22 60.66,17.37 60.96,17.68 IC11.11 | v15.39,53.19 15.39,49.53 v17.37,47.55 | v5.64,25.15 v5.64,37.95 | v20.57,11.12 v13.41,18.29
A15  (via drill 0.3)
  Top 0.152: HDR1.23 47.09,43.28 47.4,43.28 48.01,43.89 49.84,43.89 50.44,43.28 50.75,43.28 IC6.23 | v17.07,27.89 18.44,29.26 19.66,29.26 20.27,29.87 20.27,31.24 20.88,31.85 26.82,31.85 v27.58,32.61 | v29.11,34.14 30.18,35.2 33.68,35.2 34.59,36.12 39.78,36.12 v41.91,38.25
  Bottom 0.152: SJ17.1 24.54,10.21 23.32,10.21 22.71,9.6 22.4,9.6 21.95,10.06 21.64,10.06 IC18.9 21.49,10.21 21.49,10.97 17.37,15.09 17.37,27.58 v17.07,27.89 | v29.11,34.14 v27.58,32.61 | v41.91,38.25 46.94,43.28 HDR1.23
A15'  (via drill 0.3)
  Top 0.152: v59.28,18.44 60.66,19.81 60.66,19.96 60.96,20.27 IC11.12 | v40.69,4.57 34.14,4.57 32.31,6.4 30.63,6.4 29.41,7.62 IC18.11 29.11,7.62 28.96,7.47 28.35,7.47 27.13,6.25 21.03,6.25 v15.24,12.04 | v13.87,64.01 13.87,68.28 18.75,73.15 18.75,73.3 19.05,73.61 IC3.15 | v5.49,55.02 5.49,50.44 5.18,50.14 5.18,48.16 8.53,44.81 9.75,44.81 10.21,45.26 v10.21,45.41
  Bottom 0.152: SJ17.2 26.21,10.06 26.98,10.06 29.11,7.92 29.11,7.62 IC18.11 | v59.28,18.44 58.37,18.44 53.95,14.02 52.27,14.02 49.38,11.12 47.4,11.12 46.94,10.67 46.94,9.6 41.91,4.57 v40.69,4.57 | v13.87,64.01 9.6,59.74 8.38,59.74 5.49,56.84 v5.49,55.02 | v10.21,45.41 10.21,45.11 10.82,44.5 11.89,44.5 14.33,42.06 14.33,39.93 17.83,36.42 17.83,32.61 11.89,26.67 10.97,26.67 10.52,26.21 10.52,26.06 7.47,23.01 7.47,14.94 8.38,14.02 10.82,14.02 12.8,12.04 v15.24,12.04
AVMA
  Top 0.152: IC6.36 50.6,76.2 49.84,76.96 48.01,76.96 47.55,76.5 47.4,76.5 47.09,76.2 HDR1.36
BA
  Top 0.152: HDR1.6 31.85,73.76 32.61,73.76 33.07,74.22 34.75,74.22 35.2,73.76 35.51,73.76 IC6.6
  Bottom 0.152: SJ1.1 36.88,74.68 35.97,73.76 35.66,73.76 IC6.6
BA0  (via drill 0.3)
  Top 0.152: IC5.10 1.37,63.4 2.29,63.4 3.66,64.77 8.53,64.77 8.69,64.62 8.99,64.62 9.14,64.77 10.36,64.77 11.43,65.84 IC3.9 11.43,66.14 11.58,66.29 11.58,66.9 12.5,67.82 12.5,67.97 17.83,73.3 v17.83,73.91
  Bottom 0.152: v17.83,73.91 17.83,79.86 18.75,80.77 18.75,80.92 19.05,81.23 IC3.18
BA1
  Top 0.152: IC5.9 1.37,66.14 2.13,66.14 5.79,69.8 9.91,69.8 11.12,71.02 11.43,71.02 IC3.7 11.43,71.32 12.19,72.08 14.63,72.08 18.75,76.2 IC3.16
BA2
  Top 0.152: IC3.5 11.28,76.2 10.82,75.74 10.67,75.74 9.91,74.98 7.92,74.98 1.83,68.89 1.68,68.89 1.37,68.58 IC5.8
  Bottom 0.152: IC3.5 12.04,76.2 12.19,76.05 14.33,76.05 18.75,71.63 18.75,71.48 19.05,71.17 IC3.14
BA3
  Top 0.152: IC3.3 11.43,81.08 10.21,79.86 10.21,78.18 9.45,77.42 7.77,77.42 1.83,71.48 1.68,71.48 1.37,71.17 IC5.7
  Bottom 0.152: IC3.12 19.05,66.14 18.75,66.45 18.75,66.6 17.98,67.36 5.79,67.36 2.13,71.02 1.37,71.02 IC5.7
BA'  (via drill 0.3)
  Top 0.152: IC18.1 25.91,30.48 28.35,28.04 29.11,28.04 IC18.19 | 21.03,57.15 20.27,57.91 20.27,58.83 21.49,60.05 21.49,60.96 IC16.1 | 21.03,57.15 24.38,57.15 26.36,59.13 28.19,59.13 28.8,58.52 29.11,58.52 IC16.19 | v14.63,46.33 14.63,50.9 18.44,54.71 19.66,54.71 20.27,55.32 20.27,56.39 21.03,57.15
  Bottom 0.152: v14.63,46.33 14.63,40.23 21.64,33.22 21.64,30.48 IC18.1 | 40.08,76.2 SJ1.2 | 40.08,76.2 46.48,82.6 47.85,82.6 50.29,85.04 51.36,85.04 52.73,86.41 53.34,86.41 IC19.1 53.34,86.26 53.65,85.95 58.52,85.95 60.66,83.82 IC19.19 | IC15.19 60.66,53.34 55.63,58.37 55.17,58.37 51.36,62.18 50.29,62.18 48.31,64.16 48.31,66.45 47.4,67.36 46.48,67.36 41.6,72.24 | 41.6,72.24 40.08,73.76 40.08,76.2 | 41.6,72.24 36.73,67.36 31.24,67.36 30.48,66.6 30.48,65.53 31.24,64.77 32.31,64.77 32.77,64.31 32.77,62.79 32.16,62.18 31.24,62.18 30.79,61.72 30.79,60.2 29.57,58.98 29.57,58.83 29.26,58.52 IC16.19
BANK0  (via drill 0.3)
  Top 0.152: v3.5,43.28 3.5,37.64 v4.42,36.73 | v5.18,21.95 5.18,9.6 8.38,6.4 v9.3,6.4
  Bottom 0.152: v3.5,43.28 3.5,44.2 11.12,51.82 12.19,51.82 12.65,51.36 12.65,49.68 11.73,48.77 11.73,48.62 11.43,48.31 IC8.4 | v4.42,36.73 4.42,25.45 5.18,24.69 v5.18,21.95 | v9.3,6.4 12.65,3.05 14.73,3.05 BANK.1
BANK1  (via drill 0.3)
  Top 0.152: v10.21,35.36 10.21,24.84 10.97,24.08 12.04,24.08 14.02,22.1 14.02,1.37 BANK.2
  Bottom 0.152: v10.21,35.36 10.21,35.81 10.06,35.97 10.06,39.01 11.12,40.08 11.12,40.23 11.43,40.54 IC8.7
BD0  (via drill 0.3)
  Top 0.152: v5.03,27.43 2.44,24.84 2.44,23.62 2.59,23.47 2.59,18.9 1.83,18.14 1.68,18.14 1.37,17.83 IC9.2 | v7.32,45.11 7.32,45.57 4.88,48.01 4.88,48.92 4.72,49.07 4.72,50.29 4.88,50.44 4.88,57.15 v3.2,58.83
  Bottom 0.152: v5.03,27.43 5.03,42.82 v7.32,45.11 | v3.2,58.83 1.37,60.66 1.37,60.96 | 1.37,60.96 1.37,61.27 2.59,62.48 2.59,69.04 1.83,69.8 0.76,69.8 0.3,70.26 0.3,71.48 0.91,72.08 1.22,72.08 1.52,72.39 1.98,72.39 2.59,73 2.59,79.25 8.38,85.04 9.3,85.04 10.21,85.95 10.21,87.33 10.82,87.94 64.16,87.94 70.71,81.38 71.02,81.38 IC7.18 | 1.37,60.96 IC5.11
BD1  (via drill 0.3)
  Top 0.152: v4.12,43.89 v4.12,41.91 | v5.79,45.57 2.74,48.62 2.74,48.92 2.9,49.07 2.9,55.93 v3.2,56.24 | v2.29,70.1 2.59,70.41 2.59,71.78 7.92,77.11 9.6,77.11 10.52,78.03 10.52,79.55 10.97,80.01 11.89,80.01 16.92,85.04 20.57,85.04 20.88,85.34 22.25,85.34 22.55,85.04 64.01,85.04 65.08,83.97 65.08,81.99 70.56,76.5 70.71,76.5 71.02,76.2 IC7.16
  Bottom 0.152: v4.12,41.91 3.81,41.6 3.81,28.19 2.74,27.13 2.74,24.99 2.9,24.84 2.9,12.5 1.37,10.97 1.37,10.21 IC9.5 | v5.79,45.57 v4.12,43.89 | 2.29,57.15 1.37,58.06 1.37,58.37 IC5.12 | 2.29,57.15 v3.2,56.24 | v2.29,70.1 2.29,69.8 3.81,68.28 3.81,58.67 2.29,57.15
BS
  Top 0.152: IC6.5 35.36,76.2 34.59,76.96 32.77,76.96 32.31,76.5 32.16,76.5 31.85,76.2 HDR1.5
BUSY
  Top 0.152: IC6.33 50.6,68.58 49.84,67.82 48.01,67.82 47.55,68.28 47.4,68.28 47.09,68.58 HDR1.33
CPU_BANK  (via drill 0.3)
  Top 0.152: v22.25,62.79 23.93,62.79 v24.54,63.4 | v38.1,69.49 38.1,51.82 v45.26,44.65 | v46.02,43.89 46.33,44.2 51.51,44.2 52.12,43.59 52.12,42.67 52.88,41.91 55.32,41.91 58.83,38.41 59.44,38.41 60.35,39.32 61.57,39.32 66.6,34.29 v66.6,33.98
  Bottom 0.152: v22.25,62.79 21.34,62.79 14.48,55.93 11.43,55.93 IC8.1 | v24.54,63.4 27.13,63.4 30.18,66.45 30.18,66.75 31.09,67.67 32.92,67.67 35.05,69.8 37.8,69.8 v38.1,69.49 | v46.02,43.89 v45.26,44.65 | v66.6,33.98 66.6,33.22 70.56,29.26 71.32,29.26 72.08,28.5 72.08,27.13 71.02,26.06 71.02,25.45 IC4.11
D0
  Top 0.152: HDR1.31 47.09,63.4 47.4,63.4 48.01,62.79 49.84,62.79 50.44,63.4 50.75,63.4 IC6.31 50.9,63.4 50.9,62.64 52.12,61.42 52.12,54.86 53.34,53.65 IC15.2
  Bottom 0.152: SJ18.1 54.56,53.34 54.41,53.49 54.1,53.49 53.95,53.34 IC15.2
D0'
  Bottom 0.152: SJ18.2 58.67,53.34 60.2,51.82 | 60.2,51.82 60.96,51.05 IC15.18 | 69.8,49.23 69.8,44.96 62.18,37.34 62.18,32 59.74,29.57 59.74,24.99 53.8,19.05 52.88,19.05 52.12,18.29 52.12,17.37 51.21,16.46 50.29,16.46 44.5,10.67 44.5,9.14 38.41,3.05 38.41,2.9 38.1,2.59 IC1.2 | 69.8,49.23 71.02,50.44 71.02,50.75 IC10.12 | 60.2,51.82 60.5,52.12 61.57,52.12 62.18,52.73 62.18,53.8 62.94,54.56 64.47,54.56 69.8,49.23
D1
  Top 0.152: IC6.30 50.6,60.96 49.84,61.72 48.01,61.72 47.55,61.27 47.4,61.27 47.09,60.96 HDR1.30
  Bottom 0.152: 53.34,50.9 53.65,50.9 54.1,51.36 54.41,51.36 54.86,50.9 56.39,50.9 SJ19.1 | 53.34,50.9 53.03,51.21 53.03,51.36 52.43,51.97 52.43,53.95 52.12,54.25 52.12,59.44 50.9,60.66 50.9,60.96 IC6.30 | 53.34,50.9 IC15.3
D1'
  Bottom 0.152: 60.96,48.46 58.67,50.75 57.91,50.75 SJ19.2 | 60.96,48.46 IC15.17 60.96,48.31 | 60.96,48.46 62.18,49.68 62.18,52.27 62.94,53.03 63.09,53.03 63.4,53.34 IC10.2
D2
  Top 0.152: HDR1.29 47.09,58.52 47.85,58.52 48.31,58.98 49.99,58.98 50.44,58.52 50.75,58.52 IC6.29 50.9,58.37 50.9,58.06 51.82,57.15 51.82,54.71 52.12,54.41 52.12,49.68 53.03,48.77 53.03,48.62 53.34,48.31 IC15.4
  Bottom 0.152: SJ20.1 56.39,48.31 55.02,48.31 54.41,47.7 54.1,47.7 53.65,48.16 53.34,48.16 IC15.4
D2'
  Bottom 0.152: IC15.16 60.96,45.87 60.5,46.33 60.5,46.48 58.83,48.16 57.91,48.16 SJ20.2
D3
  Top 0.152: HDR1.28 47.09,55.78 47.4,55.78 48.01,55.17 49.84,55.17 50.44,55.78 50.75,55.78 IC6.28
  Bottom 0.152: SJ21.1 54.56,45.72 54.41,45.87 54.1,45.87 53.95,45.72 IC15.5 53.34,46.02 52.12,47.24 52.12,53.8 50.9,55.02 50.9,55.78 IC6.28
D3'
  Bottom 0.152: SJ21.2 58.67,45.72 60.96,43.43 IC15.15
D4
  Top 0.152: IC6.27 50.6,53.34 49.84,54.1 48.01,54.1 47.55,53.65 47.4,53.65 47.09,53.34 HDR1.27
  Bottom 0.152: 53.34,43.28 53.65,43.28 54.1,43.74 54.41,43.74 54.86,43.28 56.39,43.28 SJ22.1 | 53.34,43.28 53.03,43.59 53.03,43.74 52.43,44.35 52.43,46.33 51.82,46.94 51.82,52.12 50.9,53.03 50.9,53.34 IC6.27 | 53.34,43.28 IC15.6
D4'
  Bottom 0.152: IC15.14 60.96,40.84 58.67,43.13 57.91,43.13 SJ22.2
D5  (via drill 0.3)
  Top 0.152: HDR1.26 47.09,50.9 47.85,50.9 48.31,51.36 49.99,51.36 50.44,50.9 50.75,50.9 IC6.26 | v48.92,43.28 50.29,41.91 52.27,41.91 53.03,41.15 53.03,41 53.34,40.69 IC15.7
  Bottom 0.152: SJ23.1 56.39,40.69 55.02,40.69 54.41,40.08 54.1,40.08 53.65,40.54 53.34,40.54 IC15.7 | v48.92,43.28 48.92,46.48 49.53,47.09 49.53,49.38 50.9,50.75 IC6.26
D5'  (via drill 0.3)
  Top 0.152: v48.92,14.33 45.57,14.33 41.91,10.67 41.6,10.67 41.15,10.21 40.69,10.21 IC1.12 | v58.83,27.89 v58.83,23.32
  Bottom 0.152: SJ23.2 57.91,40.54 58.83,40.54 60.5,38.86 60.5,38.71 60.96,38.25 IC15.13 60.96,37.49 61.11,37.34 61.11,37.19 61.87,36.42 61.87,32.16 59.44,29.72 59.44,28.5 v58.83,27.89 | v48.92,14.33 48.92,14.63 50.44,16.15 51.36,16.15 51.97,16.76 53.65,16.76 58.83,21.95 v58.83,23.32
D6
  Top 0.152: HDR1.25 47.09,48.16 47.4,48.16 48.01,47.55 49.84,47.55 50.44,48.16 50.75,48.16 IC6.25
  Bottom 0.152: SJ24.1 54.56,38.1 54.41,38.25 54.1,38.25 53.95,38.1 IC15.8 53.34,38.41 52.73,39.01 52.73,39.47 52.12,40.08 52.12,46.18 50.9,47.4 50.9,48.16 IC6.25
D6'  (via drill 0.3)
  Top 0.152: v22.86,35.66 13.41,35.66 10.52,32.77 10.52,29.11 11.12,28.5 11.12,28.35 11.43,28.04 IC2.2 | v29.87,34.14 32.46,34.14 33.38,33.22 33.68,33.22 33.83,33.38 34.75,33.38 35.66,34.29 35.66,34.9 36.58,35.81 47.55,35.81 48.92,37.19 59.13,37.19 60.66,35.66 60.96,35.66 IC15.12 | v55.32,45.11 57.3,47.09 57.3,61.57 60.5,64.77 61.42,64.77 62.18,65.53 62.18,66.45 63.09,67.36 64.01,67.36 64.77,68.12 64.77,82.75 64.01,83.52 63.86,83.52 63.55,83.82 IC7.2 | v55.17,43.89 55.17,42.82 v58.98,39.01
  Bottom 0.152: 58.06,38.1 58.67,38.1 60.96,35.81 IC15.12 | v22.86,35.66 28.35,35.66 v29.87,34.14 | v55.32,45.11 55.17,44.96 v55.17,43.89 | 58.06,38.1 v58.98,39.01 | 58.06,38.1 SJ24.2
D7
  Top 0.152: IC6.24 50.6,45.72 49.84,44.96 48.01,44.96 47.55,45.41 47.4,45.41 47.09,45.72 HDR1.24
  Bottom 0.152: 53.34,35.66 53.65,35.66 54.1,36.12 54.41,36.12 54.86,35.66 56.39,35.66 SJ25.1 | 53.34,35.66 53.03,35.97 53.03,36.12 52.12,37.03 52.12,38.56 51.36,39.32 50.29,39.32 49.53,40.08 49.53,44.65 50.6,45.72 IC6.24 | 53.34,35.66 IC15.9
D7'  (via drill 0.3)
  Top 0.152: v62.79,35.66 61.72,34.59 60.2,34.59 59.74,35.05 v59.74,35.2
  Bottom 0.152: 59.28,34.9 60.96,33.22 IC15.11 | 59.28,34.9 58.67,35.51 57.91,35.51 SJ25.2 | v62.79,35.66 62.79,37.03 70.1,44.35 70.1,49.07 70.56,49.53 71.63,49.53 72.08,49.99 72.08,51.36 71.32,52.12 70.56,52.12 69.8,52.88 69.8,72.24 63.86,78.18 63.86,78.33 63.55,78.64 IC7.4 | v59.74,35.2 59.44,34.9 59.28,34.9
E
  Top 0.152: HDR1.34 47.09,71.02 47.4,71.02 48.01,70.41 49.84,70.41 50.44,71.02 50.75,71.02 IC6.34
  Bottom 0.152: SJ26.1 54.56,83.82 54.41,83.97 54.1,83.97 53.95,83.82 IC19.2 53.34,83.52 52.73,82.91 52.73,82.45 52.12,81.84 52.12,72.69 50.9,71.48 50.9,71.17 IC6.34
E'  (via drill 0.3)
  Top 0.152: v37.95,30.18 v34.44,26.67 | v48.31,39.32 57.45,39.32 59.89,36.88 62.48,36.88 v65.99,33.38 | v48.62,46.94 53.8,46.94 54.56,47.7 54.56,60.35 55.02,60.81 55.02,66.9 60.5,72.39 61.42,72.39 62.18,73.15 62.18,79.86 61.27,80.77 61.27,80.92 60.96,81.23 IC19.18
  Bottom 0.152: SJ26.2 58.67,83.82 60.96,81.53 IC19.18 | v34.44,26.67 34.44,20.27 32.31,18.14 32.16,18.14 31.85,17.83 IC13.6 | v37.95,30.18 37.95,30.79 46.48,39.32 v48.31,39.32 48.31,43.43 48.62,43.74 v48.62,46.94 | v65.99,33.38 71.02,28.35 71.02,28.04 IC4.12
GND  (9 unrouted)
  pour Bottom: 0,91.44 72.39,91.44 72.39,0 0,0
  pour Top: 0,91.44 72.39,91.44 72.39,0 0,0
LIC
  Top 0.152: HDR1.38 47.09,81.38 47.85,81.38 48.31,81.84 49.99,81.84 50.44,81.38 50.75,81.38 IC6.38
MMU_EN  (via drill 0.3)
  Top 0.152: v16.76,26.52 19.2,26.52 19.36,26.67 26.98,26.67 v27.13,26.52 | v33.22,24.69 33.83,24.69 38.71,29.57 41.3,29.57 v41.6,29.87
  Bottom 0.152: v16.76,26.52 16.76,25.91 11.73,20.88 11.73,20.73 11.43,20.42 IC2.5 | v27.13,26.52 27.89,25.76 27.89,24.99 28.8,24.08 32.61,24.08 v33.22,24.69 | v41.6,29.87 42.22,29.26 49.23,29.26 50.44,28.04 50.75,28.04 IC17.13
N$1
  Bottom 0.152: IC8.3 11.43,50.6 10.67,49.84 10.67,49.68 2.9,41.91 0.76,41.91 0.3,41.45 0.3,40.08 1.07,39.32 1.83,39.32 2.59,38.56 2.59,27.43 2.44,27.28 2.44,23.62 2.59,23.47 2.59,14.33 1.37,13.11 1.37,12.8 IC9.4
N$2  (via drill 0.3)
  Top 0.152: v12.8,40.23 12.8,41.6 11.43,42.98 IC8.6
  Bottom 0.152: v12.8,40.23 12.8,37.19 10.21,34.59 10.21,26.21 3.96,19.96 3.96,8.08 1.37,5.49 1.37,5.18 IC9.7
ON/!OFF  (via drill 0.3)
  Top 0.152: R1.1 71.17,5.03 71.17,1.37 512K.1 | v55.02,21.03 55.93,21.03 60.5,16.46 v61.57,16.46
  Bottom 0.152: IC11.1 53.34,24.69 55.02,23.01 v55.02,21.03 | v61.57,16.46 71.17,6.86 71.17,5.18 R1.1
Q
  Top 0.152: HDR1.35 47.09,73.76 47.85,73.76 48.31,74.22 49.99,74.22 50.44,73.76 50.75,73.76 IC6.35
R/!W
  Top 0.152: HDR1.32 47.09,66.14 47.85,66.14 48.31,66.6 49.99,66.6 50.44,66.14 50.75,66.14 IC6.32 50.9,66.14 50.9,66.9 52.12,68.12 52.12,71.63 52.88,72.39 53.8,72.39 54.56,73.15 54.56,79.86 53.65,80.77 53.65,80.92 53.34,81.23 IC19.3
  Bottom 0.152: SJ27.1 56.39,81.38 54.86,81.38 54.41,81.84 54.1,81.84 53.65,81.38 53.34,81.38 IC19.3
R/!W'  (via drill 0.3)
  Top 0.152: v37.19,26.06 31.85,20.73 31.85,20.42 IC13.5 | IC19.17 60.96,78.64 60.66,78.33 60.66,78.18 54.71,72.24 54.71,60.96 53.65,59.89 53.65,56.24 53.34,55.93 IC15.1
  Bottom 0.152: IC19.17 60.96,78.94 58.67,81.23 57.91,81.23 SJ27.2 | v37.19,26.06 37.19,27.89 35.36,29.72 35.36,33.68 35.2,33.83 35.2,35.05 35.36,35.2 35.36,36.58 34.29,37.64 34.29,46.18 35.05,46.94 35.97,46.94 46.18,57.15 47.55,57.15 49.53,59.13 49.53,61.42 49.99,61.87 51.21,61.87 53.03,60.05 53.03,56.24 53.34,55.93 IC15.1
TASK  (via drill 0.3)
  Top 0.152: v69.04,19.05 v63.55,13.56 | v64.16,37.64 64.16,38.1 62.18,40.08 62.18,41.15 61.42,41.91 60.5,41.91 59.74,42.67 v59.74,48.01 | v53.95,49.38 54.25,49.07 54.25,47.85 53.65,47.24 52.58,47.24 52.12,47.7 52.12,48.77 51.36,49.53 46.48,49.53 39.32,56.69 v39.32,70.71 | v32.92,73 32.61,72.69 30.94,72.69 30.48,73.15 30.48,74.22 29.72,74.98 24.54,74.98 22.1,77.42 20.57,77.42 19.36,78.64 19.05,78.64 IC3.17
  Bottom 0.152: v63.55,13.56 61.42,11.43 60.5,11.43 59.74,10.67 59.74,9.6 51.36,1.22 46.79,1.22 46.02,1.98 46.02,2.13 45.72,2.44 IC1.5 | v69.04,19.05 64.01,24.08 63.09,24.08 62.48,24.69 62.48,26.21 61.87,26.82 61.87,31.24 62.48,31.85 62.48,34.59 64.16,36.27 v64.16,37.64 | v59.74,48.01 59.13,48.62 59.13,48.77 58.52,49.38 55.63,49.38 55.47,49.53 54.1,49.53 v53.95,49.38 | v39.32,70.71 37.8,70.71 36.12,72.39 33.53,72.39 v32.92,73
TSC
  Top 0.152: IC6.39 50.6,83.82 49.84,84.58 48.01,84.58 47.55,84.12 47.4,84.12 47.09,83.82 HDR1.39
VBANK0  (via drill 0.3)
  Top 0.152: IC8.2 11.43,53.65 12.65,54.86 12.65,60.35 17.83,65.53 17.83,69.19 18.44,69.8 19.51,69.8 20.27,70.56 20.27,71.63 21.03,72.39 22.1,72.39 v23.47,73.76 | v29.87,80.01 36.27,80.01 46.48,69.8 47.85,69.8 v49.23,68.43 | v62.18,54.71 62.18,54.41 62.48,54.1 62.48,49.99 62.94,49.53 68.12,49.53 70.71,46.94 v71.17,46.94
  Bottom 0.152: v23.47,73.76 23.47,74.83 28.65,80.01 v29.87,80.01 | v49.23,68.43 50.29,67.36 53.8,67.36 62.18,58.98 v62.18,54.71 | v71.17,46.94 72.08,46.02 72.08,44.96 71.02,43.89 71.02,43.28 IC10.9
VBANK1  (via drill 0.3)
  Top 0.152: v14.02,43.43 17.07,43.43 18.59,41.91 20.57,41.91 20.88,41.6 23.62,41.6 26.82,44.81 29.57,44.81 30.18,45.41 30.18,46.48 29.72,46.94 v29.57,46.94 | v29.87,42.06 30.48,42.67 30.48,43.74 31.24,44.5 36.12,44.5 36.88,45.26 36.88,46.18 v36.58,46.48 | v44.04,46.63 46.18,46.63 46.48,46.94 47.85,46.94 48.46,46.33 49.68,46.33 49.99,46.63 53.95,46.63 54.25,46.94 v55.47,46.94
  Bottom 0.152: IC8.5 11.73,45.72 v14.02,43.43 | v29.57,46.94 29.72,46.94 30.18,46.48 30.18,42.37 v29.87,42.06 | v36.58,46.48 43.89,46.48 v44.04,46.63 | v55.47,46.94 55.63,47.09 58.67,47.09 58.83,46.94 58.98,46.94 59.74,46.18 59.74,45.11 60.35,44.5 61.57,44.5 62.64,45.57 63.25,45.57 63.4,45.72 IC10.5
VCC
  Top 0.152: C12.1 26.67,89.15 26.82,89 | 26.82,89 29.11,86.72 29.11,86.41 IC12.16 | 8.99,86.41 6.4,89 6.4,90.07 C5.1 | 18.29,88.39 C3.1 16.46,90.07 15.24,88.85 11.58,88.85 9.45,86.72 9.3,86.72 8.99,86.41 | 18.29,88.39 18.29,87.33 19.05,86.56 IC3.20 | 8.99,86.41 IC5.28 | 26.82,89 26.21,88.39 18.29,88.39 | HDR1.7 31.85,71.02 32.16,71.02 32.77,70.41 34.59,70.41 35.2,71.02 35.51,71.02 IC6.7 | IC16.20 29.11,60.96 29.11,61.27 28.65,61.72 28.65,62.79 C16.1 24.08,62.18 19.96,62.18 17.53,59.74 16.61,59.74 C8.1 16.46,59.59 16.46,58.67 18.75,56.39 18.75,56.24 19.05,55.93 IC8.16 19.05,55.78 18.75,55.78 12.5,49.53 10.97,49.53 7.92,46.48 | 7.92,46.48 8.69,45.72 IC14.16 | 7.92,46.48 6.4,48.01 6.4,49.53 C14.1 | 60.2,88.39 C19.1 | 60.2,88.39 60.2,87.33 60.96,86.56 IC19.20 | 68.58,89.76 68.58,89.15 71.02,86.72 71.02,86.41 IC7.20 | 68.58,89.76 C7.1 68.58,90.07 | 60.2,88.39 66.75,88.39 68.12,89.76 68.58,89.76 | C10.1 68.58,58.67 68.73,58.52 | 68.73,58.52 71.02,56.24 71.02,55.93 IC10.14 | 68.89,35.51 71.02,33.38 71.02,33.07 IC4.14 | 68.89,35.51 68.58,35.81 C4.1 68.58,42.98 71.02,45.41 71.02,45.72 | 60.81,56.08 60.66,56.24 60.66,56.39 58.37,58.67 58.37,59.59 C15.1 | 60.81,56.08 60.96,55.93 IC15.20 | IC15.20 60.96,55.78 61.11,55.63 61.11,55.02 62.18,53.95 62.18,49.84 63.4,48.62 63.4,48.31 IC10.4 63.55,48.16 63.86,48.16 64.31,47.7 68.89,47.7 70.56,46.02 70.71,46.02 71.02,45.72 | 71.02,45.72 IC10.10 | 68.73,58.52 67.36,57.15 62.03,57.15 60.96,56.08 60.81,56.08 | 60.81,56.08 IC15.20 | 9.6,21.34 10.67,22.4 10.82,22.4 11.28,22.86 IC2.4 | 9.6,21.34 8.99,20.73 8.99,20.42 IC9.16 | C9.1 8.84,21.64 9.3,21.64 9.6,21.34
  Top 0.152: 18.29,31.55 18.59,31.24 18.59,31.09 19.05,30.63 IC2.14 | 18.29,31.55 16.46,33.38 16.46,34.29 C2.1 | 28.65,32.31 C18.1 24.54,32.16 18.9,32.16 18.29,31.55 | 28.65,32.31 28.65,31.24 29.11,30.79 29.11,30.48 IC18.20 | 59.44,28.19 60.2,27.43 60.2,26.36 60.96,25.6 IC11.14 | 59.44,28.19 C11.1 56.84,30.79 51.82,30.79 51.66,30.63 51.05,30.63 50.9,30.48 IC17.14 50.6,30.48 49.53,31.55 | C1.1 32.77,7.62 35.2,10.06 35.51,10.06 IC1.14 35.66,10.06 35.97,10.06 42.22,3.81 43.43,3.81 43.59,3.66 | 43.59,3.66 45.26,5.33 45.26,8.99 45.57,9.3 45.57,9.91 45.72,10.06 IC1.10 45.72,10.21 46.02,10.52 46.02,10.67 49.53,14.17 49.53,16.31 50.9,17.68 IC17.9 | 43.59,3.66 43.28,3.35 43.28,2.59 IC1.4 | 49.53,31.55 48.31,32.77 48.31,34.29 C17.1 | 36.88,32.92 36.88,32.77 39.17,30.48 IC13.16 | 36.88,32.92 36.88,34.29 C13.1 | 49.53,31.55 43.28,25.3 IC17.3 | 28.65,32.31 33.22,32.31 33.83,32.92 36.88,32.92 | 68.89,35.51 65.08,31.7 62.94,31.7 59.44,28.19
  Bottom 0.152: C16.1 27.58,65.68 28.04,65.68 30.48,68.12 30.48,69.65 31.39,70.56 31.39,70.71 31.7,71.02 HDR1.7 31.85,71.17 30.48,72.54 30.48,84.89 29.57,85.8 29.57,85.95 29.26,86.26 IC12.16 | C10.1 68.58,65.23 64.01,69.8 63.09,69.8 62.18,70.71 62.18,84.89 61.27,85.8 61.27,85.95 60.96,86.26 IC19.20 | IC2.4 11.43,23.16 18.29,30.02 18.44,30.02 18.9,30.48 IC2.14 | R1.2 64.77,19.05 64.77,20.88 64.01,21.64 62.94,21.64 62.18,22.4 62.18,23.47 61.11,24.54 61.11,25.15 60.96,25.3 IC11.14 | 44.5,21.95 43.28,20.73 43.28,20.42 IC17.5 | 44.5,21.95 44.5,23.32 43.28,24.54 43.28,25.3 IC17.3 43.28,25.45 41.91,26.82 41.91,27.13 40.39,28.65 40.39,29.72 39.93,30.18 39.78,30.18 39.47,30.48 IC13.16 | 49.53,21.79 49.53,19.81 50.29,19.05 50.29,18.75 50.75,18.29 50.75,17.83 IC17.9 | 49.53,21.79 50.6,22.86 IC17.11 | 44.5,21.95 49.38,21.95 49.53,21.79 | IC14.16 8.99,45.72 9.3,45.41 9.45,45.41 10.21,44.65 10.21,42.67 10.97,41.91 11.89,41.91 16.46,37.34 16.46,34.29 C2.1
VSS
  Top 0.152: HDR1.1 31.85,86.41 35.51,86.41 IC6.1